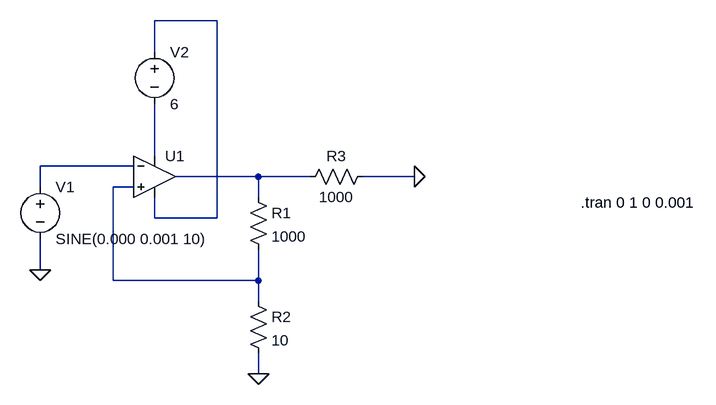
[diagram p0: schematic just-opamp.asc]
just-opamp.asc, the LTspice schematic file:
Version 4
SHEET 1 912 680
WIRE 128 -224 32 -224
WIRE 32 -176 32 -224
WIRE 32 -16 32 -96
WIRE 0 0 -144 0
WIRE 192 16 64 16
WIRE 272 16 192 16
WIRE 432 16 352 16
WIRE -144 32 -144 0
WIRE 0 32 -32 32
WIRE 192 48 192 16
WIRE 32 80 32 48
WIRE 128 80 128 -224
WIRE 128 80 32 80
WIRE -144 160 -144 112
WIRE -32 176 -32 32
WIRE 192 176 192 128
WIRE 192 176 -32 176
WIRE 192 208 192 176
WIRE 192 320 192 288
FLAG 192 320 0
FLAG -144 160 0
FLAG 432 16 0
SYMBOL Voltage -144 16 R0
SYMATTR InstName V1
SYMATTR Value SINE(0.000 0.001 10)
SYMBOL Res 176 32 R0
SYMATTR InstName R1
SYMATTR Value 1000
SYMBOL Res 176 192 R0
SYMATTR InstName R2
SYMATTR Value 10
SYMBOL OpAmps/UniversalOpAmp 32 16 R0
SYMATTR InstName U1
SYMBOL Voltage 32 -192 R0
SYMATTR InstName V2
SYMATTR Value 6
SYMBOL Res 368 0 R90
WINDOW 0 0 56 VBottom 2
WINDOW 3 32 56 VTop 2
SYMATTR InstName R3
SYMATTR Value 1000
TEXT 688 56 Left 2 !.tran 0 1 0 0.001

The netlist it stands for:
* just-opamp.asc
V1 N003 0 SINE(0.000 0.001 10)
R1 N004 N005 1000
R2 N005 0 10
XU1 N005 N003 N002 N001 N004 level1 Avol=1Meg GBW=10Meg Vos=0 En=0 Enk=0 In=0 Ink=0 Rin=500Meg  ; pins In+ In- V+ V- OUT
V2 N001 N002 6
R3 0 N004 1000
.tran 0 1 0 0.001
.lib UniversalOpAmp1.lib
.backanno
.end